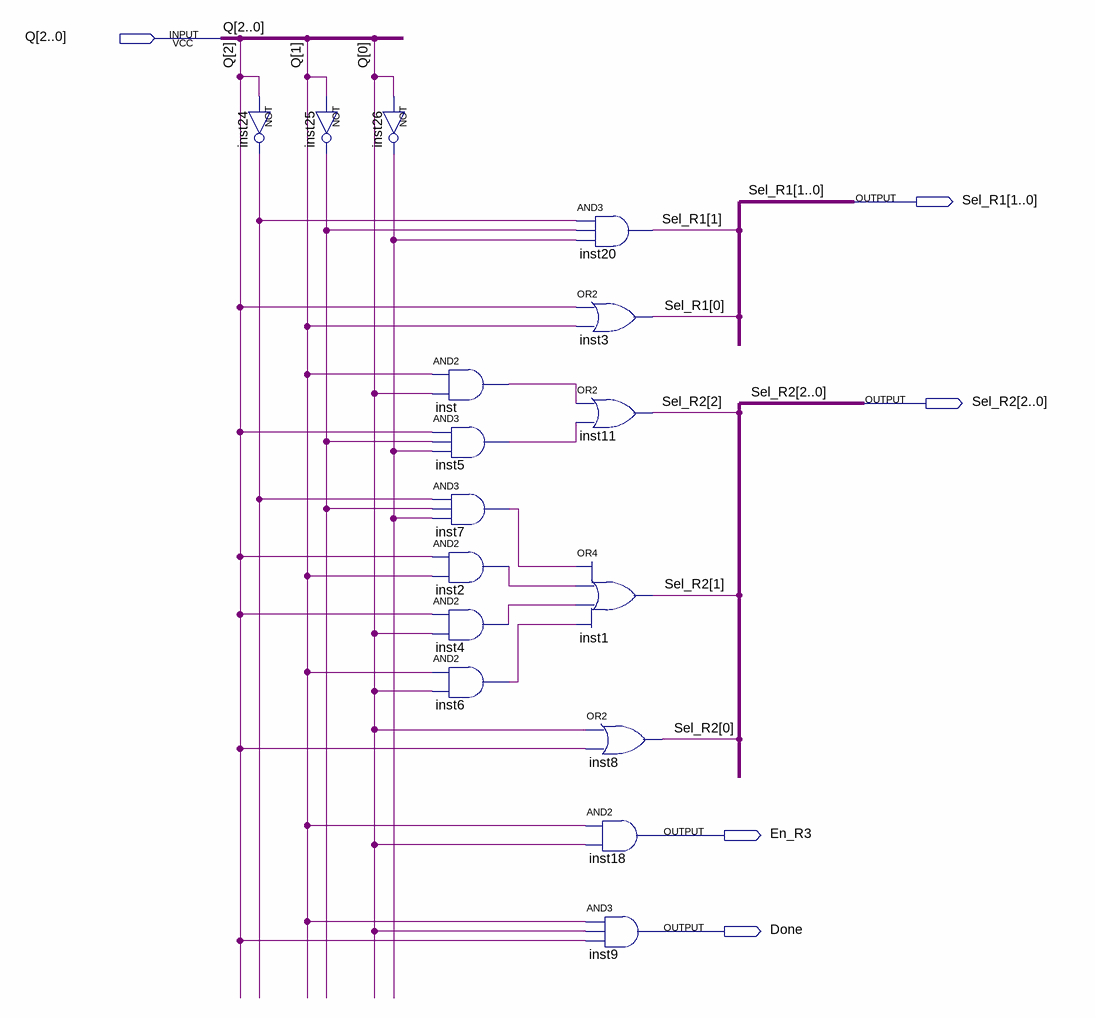
[diagram p0: schematic sheet]
// Quartus schematic Logic_output.bdf as structural Verilog: 16 symbols, 5 pins
module Logic_output (
  input  [2:0] Q,
  output [1:0] Sel_R1,
  output [2:0] Sel_R2,
  output En_R3,
  output Done
);

  wire inst2_out, inst4_out, inst5_out, inst6_out, inst7_out, inst24_out, inst25_out, inst26_out, inst_out;

  not inst24 (inst24_out, Q[2]);
  not inst25 (inst25_out, Q[1]);
  not inst26 (inst26_out, Q[0]);
  and inst (inst_out, Q[1], Q[0]);
  and inst5 (inst5_out, Q[2], inst25_out, inst26_out);
  and inst7 (inst7_out, inst24_out, inst25_out, inst26_out);
  and inst2 (inst2_out, Q[2], Q[1]);
  and inst4 (inst4_out, Q[2], Q[0]);
  and inst6 (inst6_out, Q[1], Q[0]);
  and inst20 (Sel_R1[1], inst24_out, inst25_out, inst26_out);
  or inst3 (Sel_R1[0], Q[2], Q[1]);
  or inst11 (Sel_R2[2], inst_out, inst5_out);
  or inst1 (Sel_R2[1], inst7_out, inst2_out, inst4_out, inst6_out);
  or inst8 (Sel_R2[0], Q[0], Q[2]);
  and inst18 (En_R3, Q[1], Q[0]);
  and inst9 (Done, Q[1], Q[0], Q[2]);
endmodule
